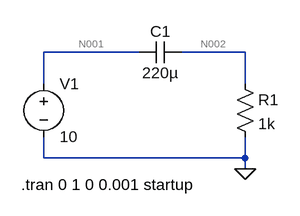
[diagram p0: schematic Fig-2.asc]
Fig-2.asc, the LTspice schematic file:
Version 4
SHEET 1 880 680
WIRE 192 64 48 64
WIRE 352 64 256 64
WIRE 48 112 48 64
WIRE 352 112 352 64
WIRE 48 224 48 192
WIRE 352 224 352 192
WIRE 352 224 48 224
WIRE 352 240 352 224
FLAG 352 240 0
SYMBOL voltage 48 96 R0
SYMATTR InstName V1
SYMATTR Value 10
SYMBOL cap 256 48 R90
WINDOW 0 0 32 VBottom 2
WINDOW 3 32 32 VTop 2
SYMATTR InstName C1
SYMATTR Value 220µ
SYMBOL res 336 96 R0
SYMATTR InstName R1
SYMATTR Value 1k
TEXT 14 264 Left 2 !.tran 0 1 0 0.001 startup

The netlist it stands for:
* Fig-2.asc
V1 N001 0 10
C1 N002 N001 220µ
R1 N002 0 1k
.tran 0 1 0 0.001 startup
.backanno
.end

* Results of the author's LTspice run, read from the files saved beside the schematic
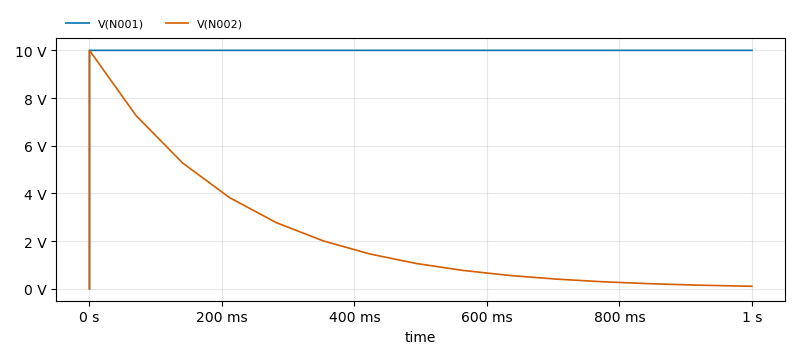
[diagram p1: Transient Analysis of Fig-2.asc, plotted from the saved traces]
* Transient Analysis, 1 run:
*   V(N001): min 0 V, max 10 V, average 10 V, rms 10 V, last 10 V
*   V(N002): min 0 V, max 10 V, average 2.195 V, rms 3.372 V, last 106.2 mV